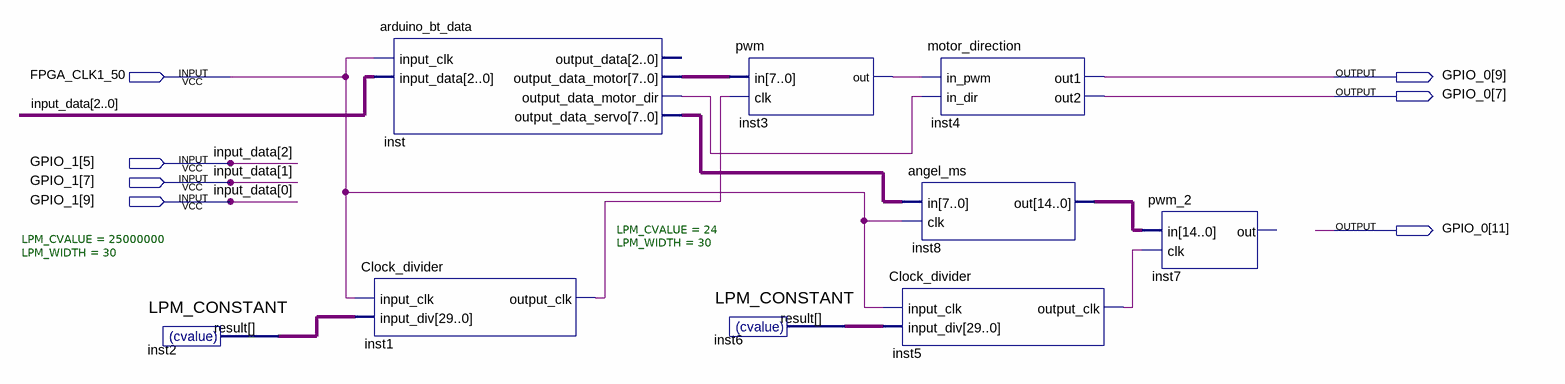
[diagram p0: schematic sheet]
// Quartus schematic Shpere_2.bdf as structural Verilog: 9 symbols, 7 pins
module Shpere_2 (
  input  FPGA_CLK1_50,
  input  [9:5] GPIO_1,
  output [11:7] GPIO_0
);

  wire inst1_output_clk, inst3_out, inst5_output_clk, inst_output_data_motor_dir;
  wire [7:0] inst_output_data_motor, inst_output_data_servo;
  wire [14:0] inst8_out;
  wire [29:0] inst2_result, inst6_result;

  LPM_CONSTANT #(.LPM_CVALUE(25000000), .LPM_WIDTH(30)) inst2 (.result(inst2_result));
  arduino_bt_data inst (
    .input_clk(FPGA_CLK1_50), .input_data({GPIO_1[5], GPIO_1[7], GPIO_1[9]}),
    .output_data_motor(inst_output_data_motor), .output_data_motor_dir(inst_output_data_motor_dir),
    .output_data_servo(inst_output_data_servo));  // open: output_data
  Clock_divider inst1 (.input_clk(FPGA_CLK1_50), .input_div(inst2_result), .output_clk(inst1_output_clk));
  pwm inst3 (.in(inst_output_data_motor), .clk(inst1_output_clk), .out(inst3_out));
  LPM_CONSTANT #(.LPM_CVALUE(24), .LPM_WIDTH(30)) inst6 (.result(inst6_result));
  motor_direction inst4 (.in_pwm(inst3_out), .in_dir(inst_output_data_motor_dir), .out1(GPIO_0[9]), .out2(GPIO_0[7]));
  angel_ms inst8 (.in(inst_output_data_servo), .clk(FPGA_CLK1_50), .out(inst8_out));
  Clock_divider inst5 (.input_clk(FPGA_CLK1_50), .input_div(inst6_result), .output_clk(inst5_output_clk));
  pwm_2 inst7 (.in(inst8_out), .clk(inst5_output_clk));  // open: out

  // Other names for the same wires on the sheet: input_data[2:0] = {GPIO_1[5], GPIO_1[7], GPIO_1[9]}
endmodule
